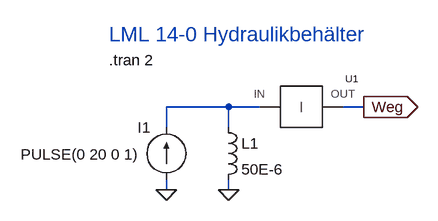
[diagram p0: schematic LML_14_0.asc]
LML_14_0.asc, the LTspice schematic file:
Version 4
SHEET 1 880 680
WIRE 208 96 112 96
WIRE 256 96 208 96
WIRE 416 96 384 96
WIRE 112 128 112 96
WIRE 208 128 208 96
WIRE 112 224 112 208
WIRE 208 224 208 208
FLAG 112 224 0
FLAG 208 224 0
FLAG 416 96 Weg
IOPIN 416 96 Out
SYMBOL ind 192 112 R0
WINDOW 0 36 40 Left 2
WINDOW 3 36 80 Left 2
SYMATTR InstName L1
SYMATTR Value 50E-6
SYMATTR SpiceLine Rser=0
SYMBOL current 112 208 R180
WINDOW 0 24 80 Left 2
WINDOW 3 42 39 Left 2
WINDOW 123 0 0 Left 0
WINDOW 39 0 0 Left 0
SYMATTR InstName I1
SYMATTR Value PULSE(0 20 0 1)
SYMBOL Mechatronik\\Control\\I-Glied 320 96 R0
SYMATTR SpiceLine ic=0
SYMATTR InstName U1
TEXT 24 24 Left 2 !.tran 2
TEXT 24 -16 Left 3 ;LML 14-0 Hydraulikbehälter

The netlist it stands for:
* LML_14_0.asc
L1 N001 0 50E-6 Rser=0
I1 0 N001 PULSE(0 20 0 1)
XU1 N001 Weg I-Glied ic=0  ; pins IN OUT
.tran 2
* LML 14-0 Hydraulikbehälter
.lib Control.lib
.backanno
.end